# Altium schematic sheet SPISensors.SchDoc
size Letter
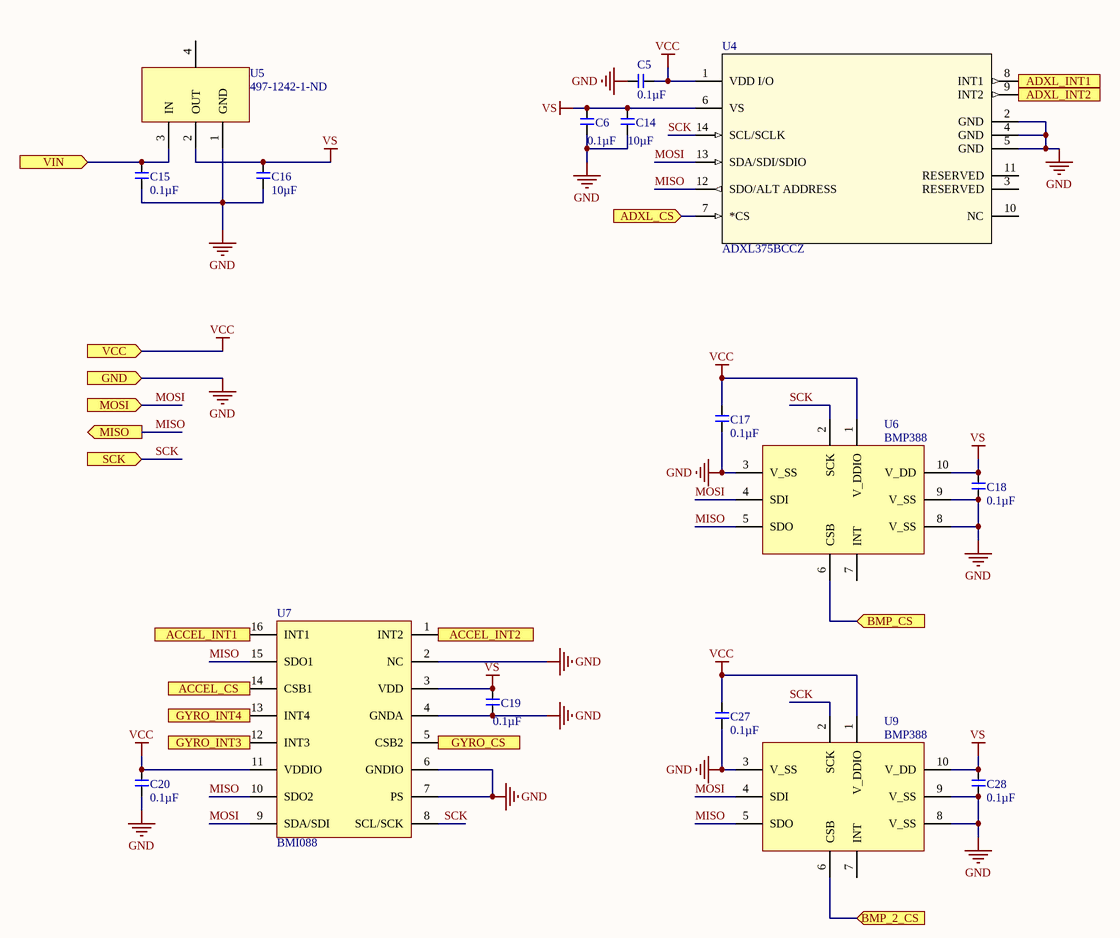
[diagram p0: SPISensors.SchDoc]

## Parts
C5  Capacitance (shorthand): 0.1µF  [C0603]  (hidden comment: __template_cap)
C6  Capacitance (shorthand): 0.1µF  [C0603]  (hidden comment: __template_cap)
C14  Capacitance (shorthand): 10µF  [C0603]  (hidden comment: __template_cap)
C15  Capacitance (shorthand): 0.1µF  [C0603]  (hidden comment: __template_cap)
C16  Capacitance (shorthand): 10µF  [C0603]  (hidden comment: __template_cap)
C17  Capacitance (shorthand): 0.1µF  [C0603]  (hidden comment: __template_cap)
C18  Capacitance (shorthand): 0.1µF  [C0603]  (hidden comment: __template_cap)
C19  Capacitance (shorthand): 0.1µF  [C0603]  (hidden comment: __template_cap)
C20  Capacitance (shorthand): 0.1µF  [C0603]  (hidden comment: __template_cap)
C27  Capacitance (shorthand): 0.1µF  [C0603]  (hidden comment: __template_cap)
C28  Capacitance (shorthand): 0.1µF  [C0603]  (hidden comment: __template_cap)
U4  ADXL375BCCZ  [LGA_CC-14-1]
U5  Supplier Part Number 1: 497-1242-1-ND  [4SOT223]  (hidden comment: REG102GA-3.3)
U6  BMP388  [8 pin LGA]
U7  BMI088  [BMI088]
U9  BMP388  [8 pin LGA]

## Ports
ACCEL_CS (in), ACCEL_INT1 (out), ACCEL_INT2 (out), ADXL_CS (in), ADXL_INT1 (out), ADXL_INT2 (out), BMP_2_CS (in), BMP_CS (in), GND (in), GYRO_CS (in), GYRO_INT3 (out), GYRO_INT4 (out), MISO (out), MOSI (in), SCK (in), VCC (in), VIN (in)

## Nets
GND: C5.2 C6.1 C14.2 C15.2 C16.2 C17.2 C18.2 C19.2 C20.2 C27.2 C28.2 U4.2(GND) U4.4(GND) U4.5(GND) U5.1(GND) U6.3(V_SS) U6.8(V_SS) U6.9(V_SS) U7.2(NC) U7.4(GNDA) U7.6(GNDIO) U7.7(PS) U9.3(V_SS) U9.8(V_SS) U9.9(V_SS) ; port GND
VCC: C5.1 C17.1 C20.1 C27.1 U4.1(VDD_I/O) U6.1(V_DDIO) U7.11(VDDIO) U9.1(V_DDIO) ; port VCC
VS: C6.2 C14.1 C16.1 C18.1 C19.1 C28.1 U4.6(VS) U5.2(OUT) U6.10(V_DD) U7.3(VDD) U9.10(V_DD)
ACCEL_CS: U7.14(CSB1) ; port ACCEL_CS
ACCEL_INT1: U7.16(INT1) ; port ACCEL_INT1
ACCEL_INT2: U7.1(INT2) ; port ACCEL_INT2
ADXL_CS: U4.7(*CS) ; port ADXL_CS
ADXL_INT1: U4.8(INT1) ; port ADXL_INT1
ADXL_INT2: U4.9(INT2) ; port ADXL_INT2
BMP_2_CS: U9.6(CSB) ; port BMP_2_CS
BMP_CS: U6.6(CSB) ; port BMP_CS
GYRO_CS: U7.5(CSB2) ; port GYRO_CS
GYRO_INT3: U7.12(INT3) ; port GYRO_INT3
GYRO_INT4: U7.13(INT4) ; port GYRO_INT4
MISO: U4.12(SDO/ALT_ADDRESS) U6.5(SDO) U7.10(SDO2) U7.15(SDO1) U9.5(SDO) ; port MISO
MOSI: U4.13(SDA/SDI/SDIO) U6.4(SDI) U7.9(SDA/SDI) U9.4(SDI) ; port MOSI
SCK: U4.14(SCL/SCLK) U6.2(SCK) U7.8(SCL/SCK) U9.2(SCK) ; port SCK
VIN: C15.1 U5.3(IN) ; port VIN

Not connected (* = marked no-connect by the designer): U4 3(RESERVED) 10(NC) 11(RESERVED); U5 4(GND); U6 7(INT); U9 7(INT)

## Library data of the parts
C5 C6 C15 C17-C20 C27 C28 = CAP CER 0603 0.1µF X7R 50V 10%: Manufacturer: Murata Electronics North America; Capacitance - pF (Machine readable): 100000; type: capacitor; Dielectric: X7R; Supplier 1: Digikey; Supplier Part Number 1: 490-1519-1-ND
C14 C16 = CAP CER 10UF 35V X5R 0603 20%: Manufacturer: Murata Electronics North America; Capacitance - pF (Machine readable): 10000000; type: capacitor; Dielectric: X5R; Supplier 1: Digikey; Supplier Part Number 1: 490-13248-1-ND
U4 = ADXL375BCCZ: 200G Accelcerometer; Value: Value; Type: Type; RefDes: RefDes; ComponentLink1Description: Datasheet; ComponentLink1URL: http://www.analog.com/media/en/technical-documentation/data-sheets/ADXL375.PDF
U5 = LDO_LD1117S33TR: IC VOLTAGE REG 3.3V 800MA SOT223; Manufacturer: STMicroelectronics; Regulator Topology: Positive Fixed; Voltage - Dropout (Typical): 1.1V @ 800mA; Number of Regulators: 1; Voltage - Input: Up to 15V; ComponentLink1URL: http://www.st.com/web/en/resource/technical/document/datasheet/CD00000544.pdf; ComponentLink1Description: http://www.st.com/web/en/resource/technical/document/datasheet/CD00000544.pdf; Supplier 1: Digi-Key; Manufacturer Part Number: LD1117S33TR; RoHS: RoHS Compliant; Category: Integrated Circuits (ICs); Stock 1: 34439; Pricing 1: 1=0.46, 10=0.373, 100=0.2541, 500=0.1902, 1000=0.14245 (USD); Packaging: Cut Tape (CT); Voltage - Output: 3.3V; Current - Output: 800mA; Current - Limit (Min): -; Operating Temperature: 0°C ~ 125°C; Mounting Type: Surface Mount; Package / Case: TO-261-4, TO-261AA; Supplier Device Package: SOT-223
U6 U9 = BMP388: Pressure Sensor 4.35 PSI ~ 18.13 PSI (30 kPa ~ 125 kPa) Absolute 10-WFLGA; Manufacturer: Bosch Sensortec; Supplier 1: Digi-Key; Manufacturer Part Number: BMP388; Stock 1: 46050; Pricing 1: 1=3.93, 5=3.466, 10=3.061, 25=2.4832, 50=2.1946, 100=2.1368, 500=1.7903, 1000=1.6748, 5000=1.5593 (USD); ComponentLink1URL: https://ae-bst.resource.bosch.com/media/_tech/media/product_flyer/BST-BMP388-FL000-00.pdf; ComponentLink1Description: https://ae-bst.resource.bosch.com/media/_tech/media/product_flyer/BST-BMP388-FL000-00.pdf
U7 = IMU_BMI088: Bosch BMI088; Supplier 1: Digi-Key; Supplier Part Number 1: 828-1082-1-ND; ComponentLink1Description: Datasheet; ComponentLink1URL: https://ae-bst.resource.bosch.com/media/_tech/media/datasheets/BST-BMI088-DS001-13.pdf